# EAGLE schematic analog_sensor_x8 (EAGLE 7.5.0)
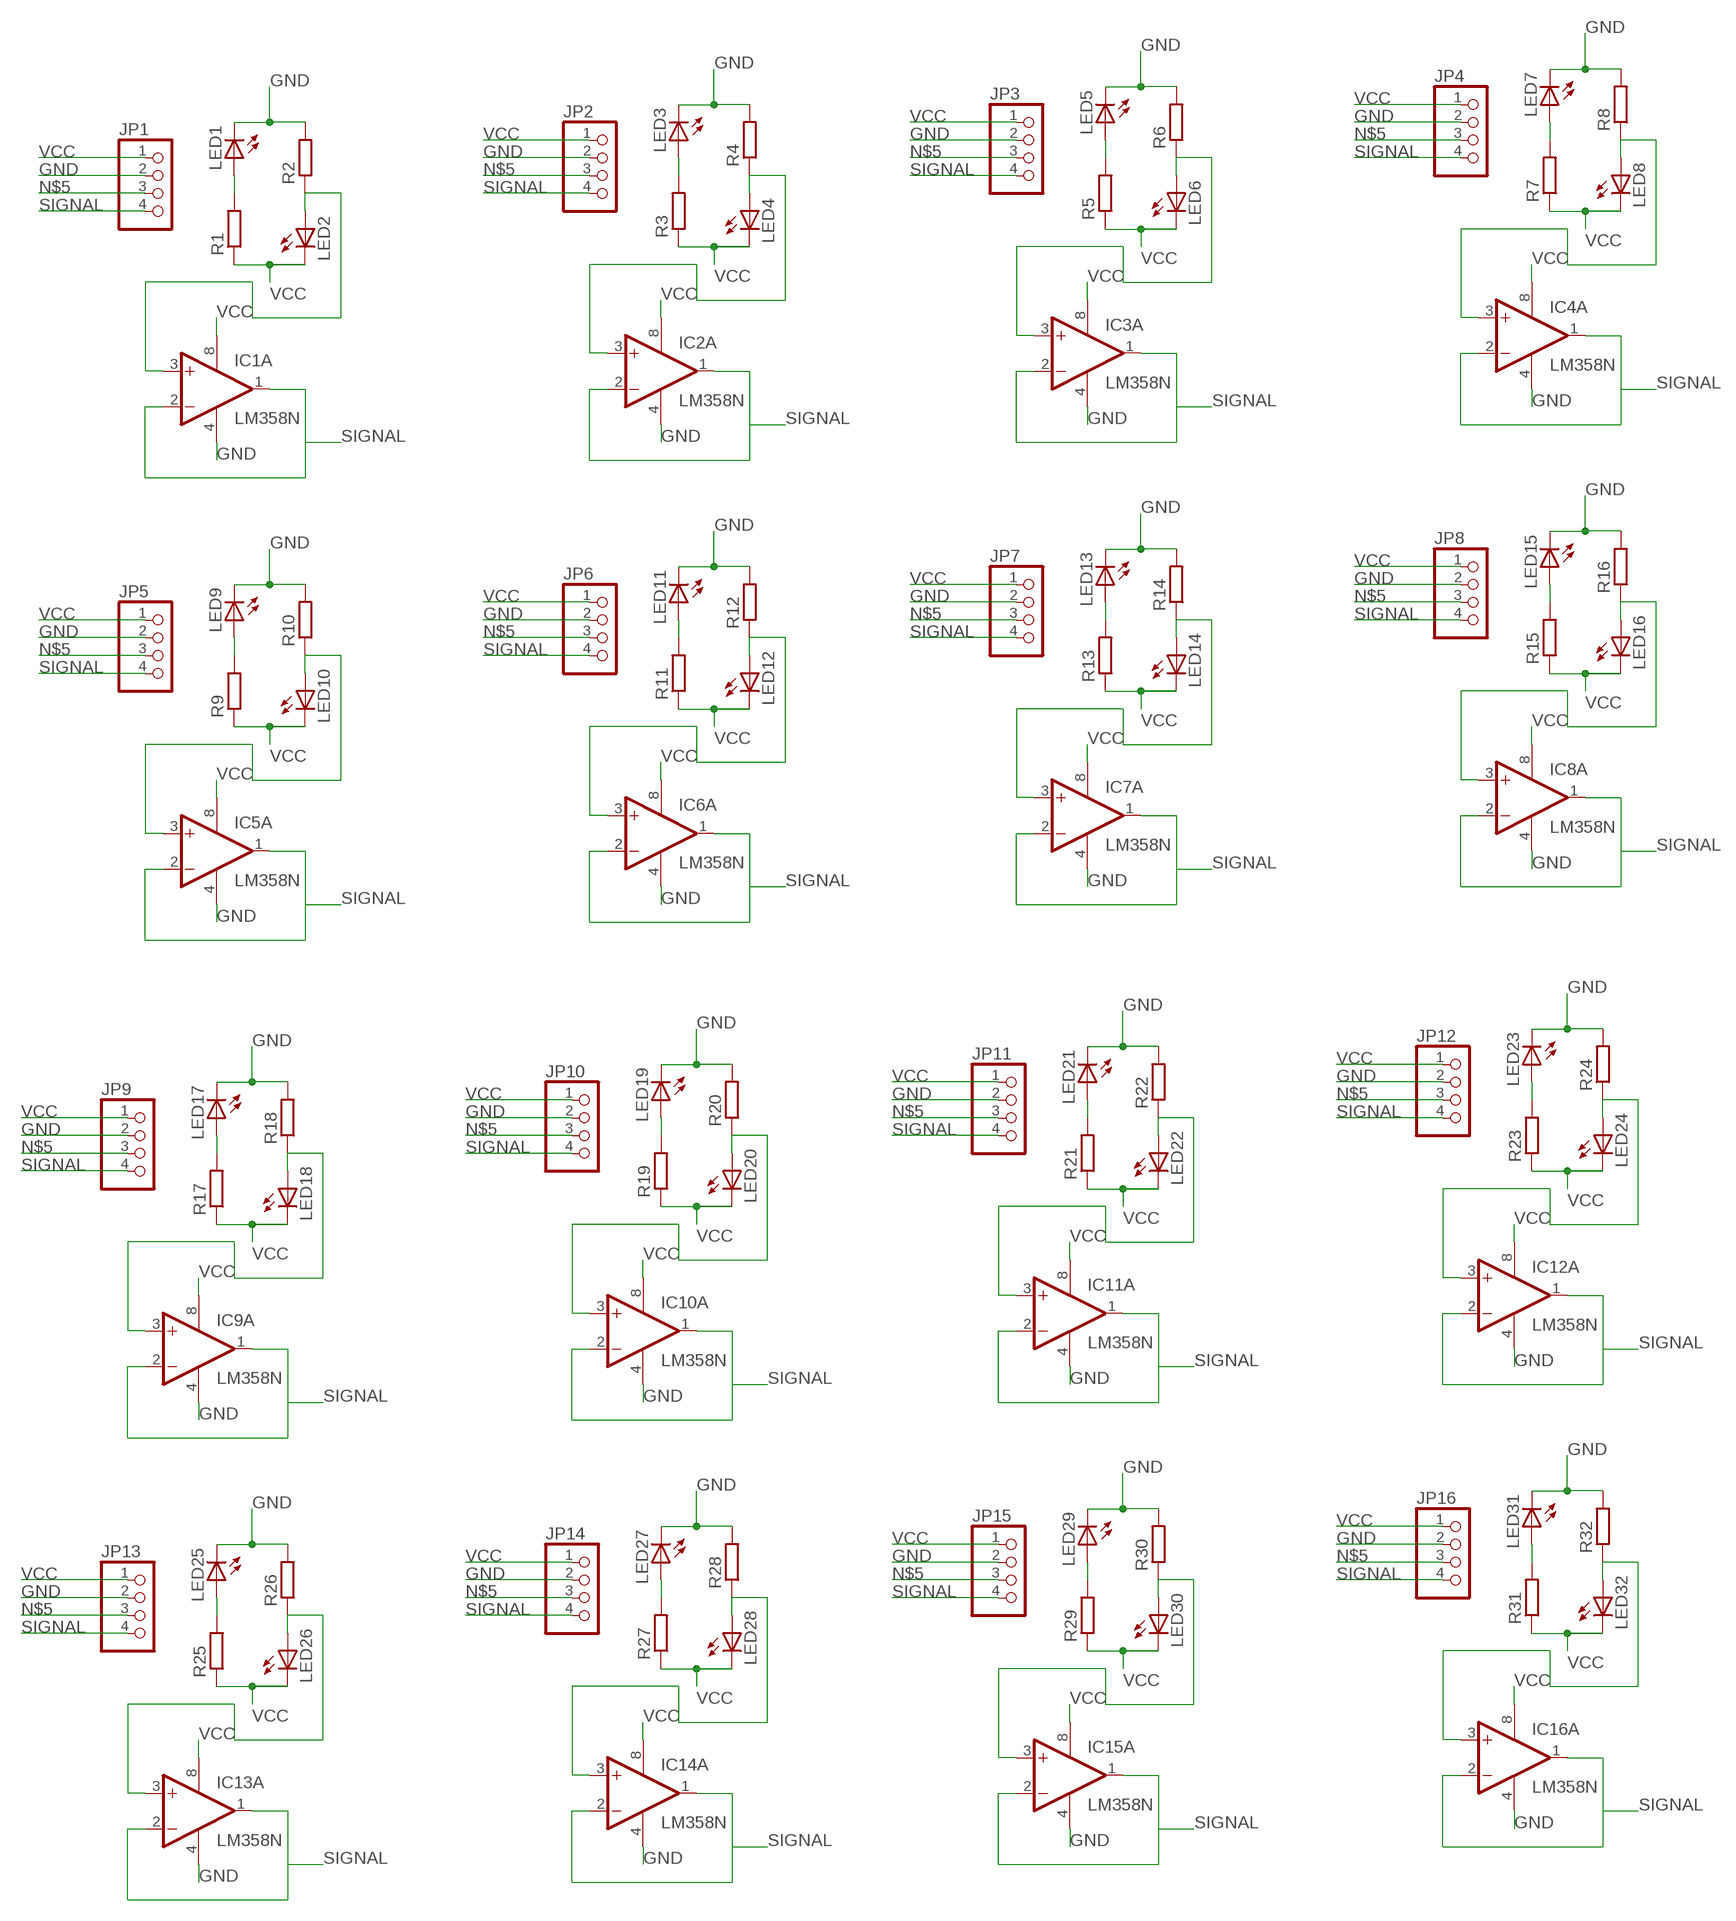
[diagram p0: schematic, sheet 1]

## Parts
IC1  LM358N  [DIL08]
IC2  LM358N  [DIL08]
IC3  LM358N  [DIL08]
IC4  LM358N  [DIL08]
IC5  LM358N  [DIL08]
IC6  LM358N  [DIL08]
IC7  LM358N  [DIL08]
IC8  LM358N  [DIL08]
IC9  LM358N  [DIL08]
IC10  LM358N  [DIL08]
IC11  LM358N  [DIL08]
IC12  LM358N  [DIL08]
IC13  LM358N  [DIL08]
IC14  LM358N  [DIL08]
IC15  LM358N  [DIL08]
IC16  LM358N  [DIL08]
JP1  PINHD-1X4  [1X04]
JP2  PINHD-1X4  [1X04]
JP3  PINHD-1X4  [1X04]
JP4  PINHD-1X4  [1X04]
JP5  PINHD-1X4  [1X04]
JP6  PINHD-1X4  [1X04]
JP7  PINHD-1X4  [1X04]
JP8  PINHD-1X4  [1X04]
JP9  PINHD-1X4  [1X04]
JP10  PINHD-1X4  [1X04]
JP11  PINHD-1X4  [1X04]
JP12  PINHD-1X4  [1X04]
JP13  PINHD-1X4  [1X04]
JP14  PINHD-1X4  [1X04]
JP15  PINHD-1X4  [1X04]
JP16  PINHD-1X4  [1X04]
LED1  LED5MM  [LED5MM]
LED2  LED5MM  [LED5MM]
LED3  LED5MM  [LED5MM]
LED4  LED5MM  [LED5MM]
LED5  LED5MM  [LED5MM]
LED6  LED5MM  [LED5MM]
LED7  LED5MM  [LED5MM]
LED8  LED5MM  [LED5MM]
LED9  LED5MM  [LED5MM]
LED10  LED5MM  [LED5MM]
LED11  LED5MM  [LED5MM]
LED12  LED5MM  [LED5MM]
LED13  LED5MM  [LED5MM]
LED14  LED5MM  [LED5MM]
LED15  LED5MM  [LED5MM]
LED16  LED5MM  [LED5MM]
LED17  LED5MM  [LED5MM]
LED18  LED5MM  [LED5MM]
LED19  LED5MM  [LED5MM]
LED20  LED5MM  [LED5MM]
LED21  LED5MM  [LED5MM]
LED22  LED5MM  [LED5MM]
LED23  LED5MM  [LED5MM]
LED24  LED5MM  [LED5MM]
LED25  LED5MM  [LED5MM]
LED26  LED5MM  [LED5MM]
LED27  LED5MM  [LED5MM]
LED28  LED5MM  [LED5MM]
LED29  LED5MM  [LED5MM]
LED30  LED5MM  [LED5MM]
LED31  LED5MM  [LED5MM]
LED32  LED5MM  [LED5MM]
R1  R-EU_0207/10  [0207/10]
R2  R-EU_0207/10  [0207/10]
R3  R-EU_0207/10  [0207/10]
R4  R-EU_0207/10  [0207/10]
R5  R-EU_0207/10  [0207/10]
R6  R-EU_0207/10  [0207/10]
R7  R-EU_0207/10  [0207/10]
R8  R-EU_0207/10  [0207/10]
R9  R-EU_0207/10  [0207/10]
R10  R-EU_0207/10  [0207/10]
R11  R-EU_0207/10  [0207/10]
R12  R-EU_0207/10  [0207/10]
R13  R-EU_0207/10  [0207/10]
R14  R-EU_0207/10  [0207/10]
R15  R-EU_0207/10  [0207/10]
R16  R-EU_0207/10  [0207/10]
R17  R-EU_0207/10  [0207/10]
R18  R-EU_0207/10  [0207/10]
R19  R-EU_0207/10  [0207/10]
R20  R-EU_0207/10  [0207/10]
R21  R-EU_0207/10  [0207/10]
R22  R-EU_0207/10  [0207/10]
R23  R-EU_0207/10  [0207/10]
R24  R-EU_0207/10  [0207/10]
R25  R-EU_0207/10  [0207/10]
R26  R-EU_0207/10  [0207/10]
R27  R-EU_0207/10  [0207/10]
R28  R-EU_0207/10  [0207/10]
R29  R-EU_0207/10  [0207/10]
R30  R-EU_0207/10  [0207/10]
R31  R-EU_0207/10  [0207/10]
R32  R-EU_0207/10  [0207/10]

## Nets
GND: IC1.4(P:V-) IC2.4(P:V-) IC3.4(P:V-) IC4.4(P:V-) IC5.4(P:V-) IC6.4(P:V-) IC7.4(P:V-) IC8.4(P:V-) IC9.4(P:V-) IC10.4(P:V-) IC11.4(P:V-) IC12.4(P:V-) IC13.4(P:V-) IC14.4(P:V-) IC15.4(P:V-) IC16.4(P:V-) JP1.2 JP2.2 JP3.2 JP4.2 JP5.2 JP6.2 JP7.2 JP8.2 JP9.2 JP10.2 JP11.2 JP12.2 JP13.2 JP14.2 JP15.2 JP16.2 LED1.K(C) LED3.K(C) LED5.K(C) LED7.K(C) LED9.K(C) LED11.K(C) LED13.K(C) LED15.K(C) LED17.K(C) LED19.K(C) LED21.K(C) LED23.K(C) LED25.K(C) LED27.K(C) LED29.K(C) LED31.K(C) R2.2 R4.2 R6.2 R8.2 R10.2 R12.2 R14.2 R16.2 R18.2 R20.2 R22.2 R24.2 R26.2 R28.2 R30.2 R32.2
N$1: IC1.3(A:+IN) LED2.A R2.1
N$2: IC2.3(A:+IN) LED4.A R4.1
N$3: LED1.A R1.2
N$4: LED3.A R3.2
N$5: JP1.3 JP2.3 JP3.3 JP4.3 JP5.3 JP6.3 JP7.3 JP8.3 JP9.3 JP10.3 JP11.3 JP12.3 JP13.3 JP14.3 JP15.3 JP16.3
N$6: IC3.3(A:+IN) LED6.A R6.1
N$7: LED5.A R5.2
N$8: IC4.3(A:+IN) LED8.A R8.1
N$9: LED7.A R7.2
N$10: IC5.3(A:+IN) LED10.A R10.1
N$11: LED9.A R9.2
N$12: IC6.3(A:+IN) LED12.A R12.1
N$13: LED11.A R11.2
N$14: IC7.3(A:+IN) LED14.A R14.1
N$15: LED13.A R13.2
N$16: IC8.3(A:+IN) LED16.A R16.1
N$17: LED15.A R15.2
N$18: IC9.3(A:+IN) LED18.A R18.1
N$19: LED17.A R17.2
N$20: IC10.3(A:+IN) LED20.A R20.1
N$21: LED19.A R19.2
N$22: IC11.3(A:+IN) LED22.A R22.1
N$23: LED21.A R21.2
N$24: IC12.3(A:+IN) LED24.A R24.1
N$25: LED23.A R23.2
N$26: IC13.3(A:+IN) LED26.A R26.1
N$27: LED25.A R25.2
N$28: IC14.3(A:+IN) LED28.A R28.1
N$29: LED27.A R27.2
N$30: IC15.3(A:+IN) LED30.A R30.1
N$31: LED29.A R29.2
N$32: IC16.3(A:+IN) LED32.A R32.1
N$33: LED31.A R31.2
SIGNAL: IC1.1(A:OUT) IC1.2(A:-IN) IC2.1(A:OUT) IC2.2(A:-IN) IC3.1(A:OUT) IC3.2(A:-IN) IC4.1(A:OUT) IC4.2(A:-IN) IC5.1(A:OUT) IC5.2(A:-IN) IC6.1(A:OUT) IC6.2(A:-IN) IC7.1(A:OUT) IC7.2(A:-IN) IC8.1(A:OUT) IC8.2(A:-IN) IC9.1(A:OUT) IC9.2(A:-IN) IC10.1(A:OUT) IC10.2(A:-IN) IC11.1(A:OUT) IC11.2(A:-IN) IC12.1(A:OUT) IC12.2(A:-IN) IC13.1(A:OUT) IC13.2(A:-IN) IC14.1(A:OUT) IC14.2(A:-IN) IC15.1(A:OUT) IC15.2(A:-IN) IC16.1(A:OUT) IC16.2(A:-IN) JP1.4 JP2.4 JP3.4 JP4.4 JP5.4 JP6.4 JP7.4 JP8.4 JP9.4 JP10.4 JP11.4 JP12.4 JP13.4 JP14.4 JP15.4 JP16.4
VCC: IC1.8(P:V+) IC2.8(P:V+) IC3.8(P:V+) IC4.8(P:V+) IC5.8(P:V+) IC6.8(P:V+) IC7.8(P:V+) IC8.8(P:V+) IC9.8(P:V+) IC10.8(P:V+) IC11.8(P:V+) IC12.8(P:V+) IC13.8(P:V+) IC14.8(P:V+) IC15.8(P:V+) IC16.8(P:V+) JP1.1 JP2.1 JP3.1 JP4.1 JP5.1 JP6.1 JP7.1 JP8.1 JP9.1 JP10.1 JP11.1 JP12.1 JP13.1 JP14.1 JP15.1 JP16.1 LED2.K(C) LED4.K(C) LED6.K(C) LED8.K(C) LED10.K(C) LED12.K(C) LED14.K(C) LED16.K(C) LED18.K(C) LED20.K(C) LED22.K(C) LED24.K(C) LED26.K(C) LED28.K(C) LED30.K(C) LED32.K(C) R1.1 R3.1 R5.1 R7.1 R9.1 R11.1 R13.1 R15.1 R17.1 R19.1 R21.1 R23.1 R25.1 R27.1 R29.1 R31.1
Unconnected: IC1.5(B:+IN) IC1.6(B:-IN) IC1.7(B:OUT) IC2.5(B:+IN) IC2.6(B:-IN) IC2.7(B:OUT) IC3.5(B:+IN) IC3.6(B:-IN) IC3.7(B:OUT) IC4.5(B:+IN) IC4.6(B:-IN) IC4.7(B:OUT) IC5.5(B:+IN) IC5.6(B:-IN) IC5.7(B:OUT) IC6.5(B:+IN) IC6.6(B:-IN) IC6.7(B:OUT) IC7.5(B:+IN) IC7.6(B:-IN) IC7.7(B:OUT) IC8.5(B:+IN) IC8.6(B:-IN) IC8.7(B:OUT) IC9.5(B:+IN) IC9.6(B:-IN) IC9.7(B:OUT) IC10.5(B:+IN) IC10.6(B:-IN) IC10.7(B:OUT) IC11.5(B:+IN) IC11.6(B:-IN) IC11.7(B:OUT) IC12.5(B:+IN) IC12.6(B:-IN) IC12.7(B:OUT) IC13.5(B:+IN) IC13.6(B:-IN) IC13.7(B:OUT) IC14.5(B:+IN) IC14.6(B:-IN) IC14.7(B:OUT) IC15.5(B:+IN) IC15.6(B:-IN) IC15.7(B:OUT) IC16.5(B:+IN) IC16.6(B:-IN) IC16.7(B:OUT)

## Library data of the parts
IC1-IC16 = linear:LM358: OP AMP also LM158; LM258; LM2904 Source: http://cache.national.com/ds/LM/LM158.pdf
JP1-JP16 = pinhead:PINHD-1X4: PIN HEADER
LED1-LED32 = led:LED: LED OSRAM: - CHIPLED LG R971, LG N971, LY N971, LG Q971, LY Q971, LO R971, LY R971 LH N974, LH R974 LS Q976, LO Q976, LY Q976 LO Q996 - Hyper CHIPLED LW Q18S LB Q993, LB Q99A, LB R99A - SideLED LS A670, LO A670, LY A670, LG A670, LP A670 LB A673, LV A673, LT A673, LW A673 LH A674 LY A675 LS A676, LA A676, LO A676, LY A676, LW A676 LS A679, LY A679, LG A679 - Hyper Micro SIDELED® LS Y876, LA Y876, LO Y876, LY Y876 LT Y87S - SmartLED LW L88C, LW L88S LB L89C, LB L89S, LG L890 LS L89K, LO L89K, LY L89K LS L896, LA L896, LO L896, LY L896 - TOPLED LS T670, LO T670, LY T670, LG T670, LP T670 LSG T670, LSP T670, LSY T670, LOP T670, LYG T670 LG T671, LOG T671, LSG T671 LB T673, LV T673, LT T673, LW T673 LH T674 LS T676, LA T676, LO T676, LY T676, LB T676, LH T676, LSB T676, LW T676 LB T67C, LV T67C, LT T67C, LS T67K, LO T67K, LY T67K, LW E67C LS E67B, LA E67B, LO E67B, LY E67B, LB E67C, LV E67C, LT E67C LW T67C LS T679, LY T679, LG T679 LS T770, LO T770, LY T770, LG T770, LP T770 LB T773, LV T773, LT T773, LW T773 LH T774 LS E675, LA E675, LY E675, LS T675 LS T776, LA T776, LO T776, LY T776, LB T776 LHGB T686 LT T68C, LB T68C - Hyper Mini TOPLED® LB M676 - Mini TOPLED Santana® LG M470 LS M47K, LO M47K, LY M47K Source: http://www.osram.convergy.de LUXEON: - LUMILED® LXK2-PW12-R00, LXK2-PW12-S00, LXK2-PW14-U00, LXK2-PW14-V00 LXK2-PM12-R00, LXK2-PM12-S00, LXK2-PM14-U00 LXK2-PE12-Q00, LXK2-PE12-R00, LXK2-PE12-S00, LXK2-PE14-T00, LXK2-PE14-U00 LXK2-PB12-K00, LXK2-PB12-L00, LXK2-PB12-M00, LXK2-PB14-N00, LXK2-PB14-P00, LXK2-PB14-Q00 LXK2-PR12-L00, LXK2-PR12-M00, LXK2-PR14-Q00, LXK2-PR14-R00 LXK2-PD12-Q00, LXK2-PD12-R00, LXK2-PD12-S00 LXK2-PH12-R00, LXK2-PH12-S00 LXK2-PL12-P00, LXK2-PL12-Q00, LXK2-PL12-R00 Source: www.luxeon.com KINGBRIGHT: KA-3528ASYC Source: www.kingbright.com
R1-R32 = resistor:R-EU_: RESISTOR, European symbol